# EAGLE design SparkFun_AST-CAN485_IO_Shield (EAGLE 9.1.1)

## Sheet 1 of 2
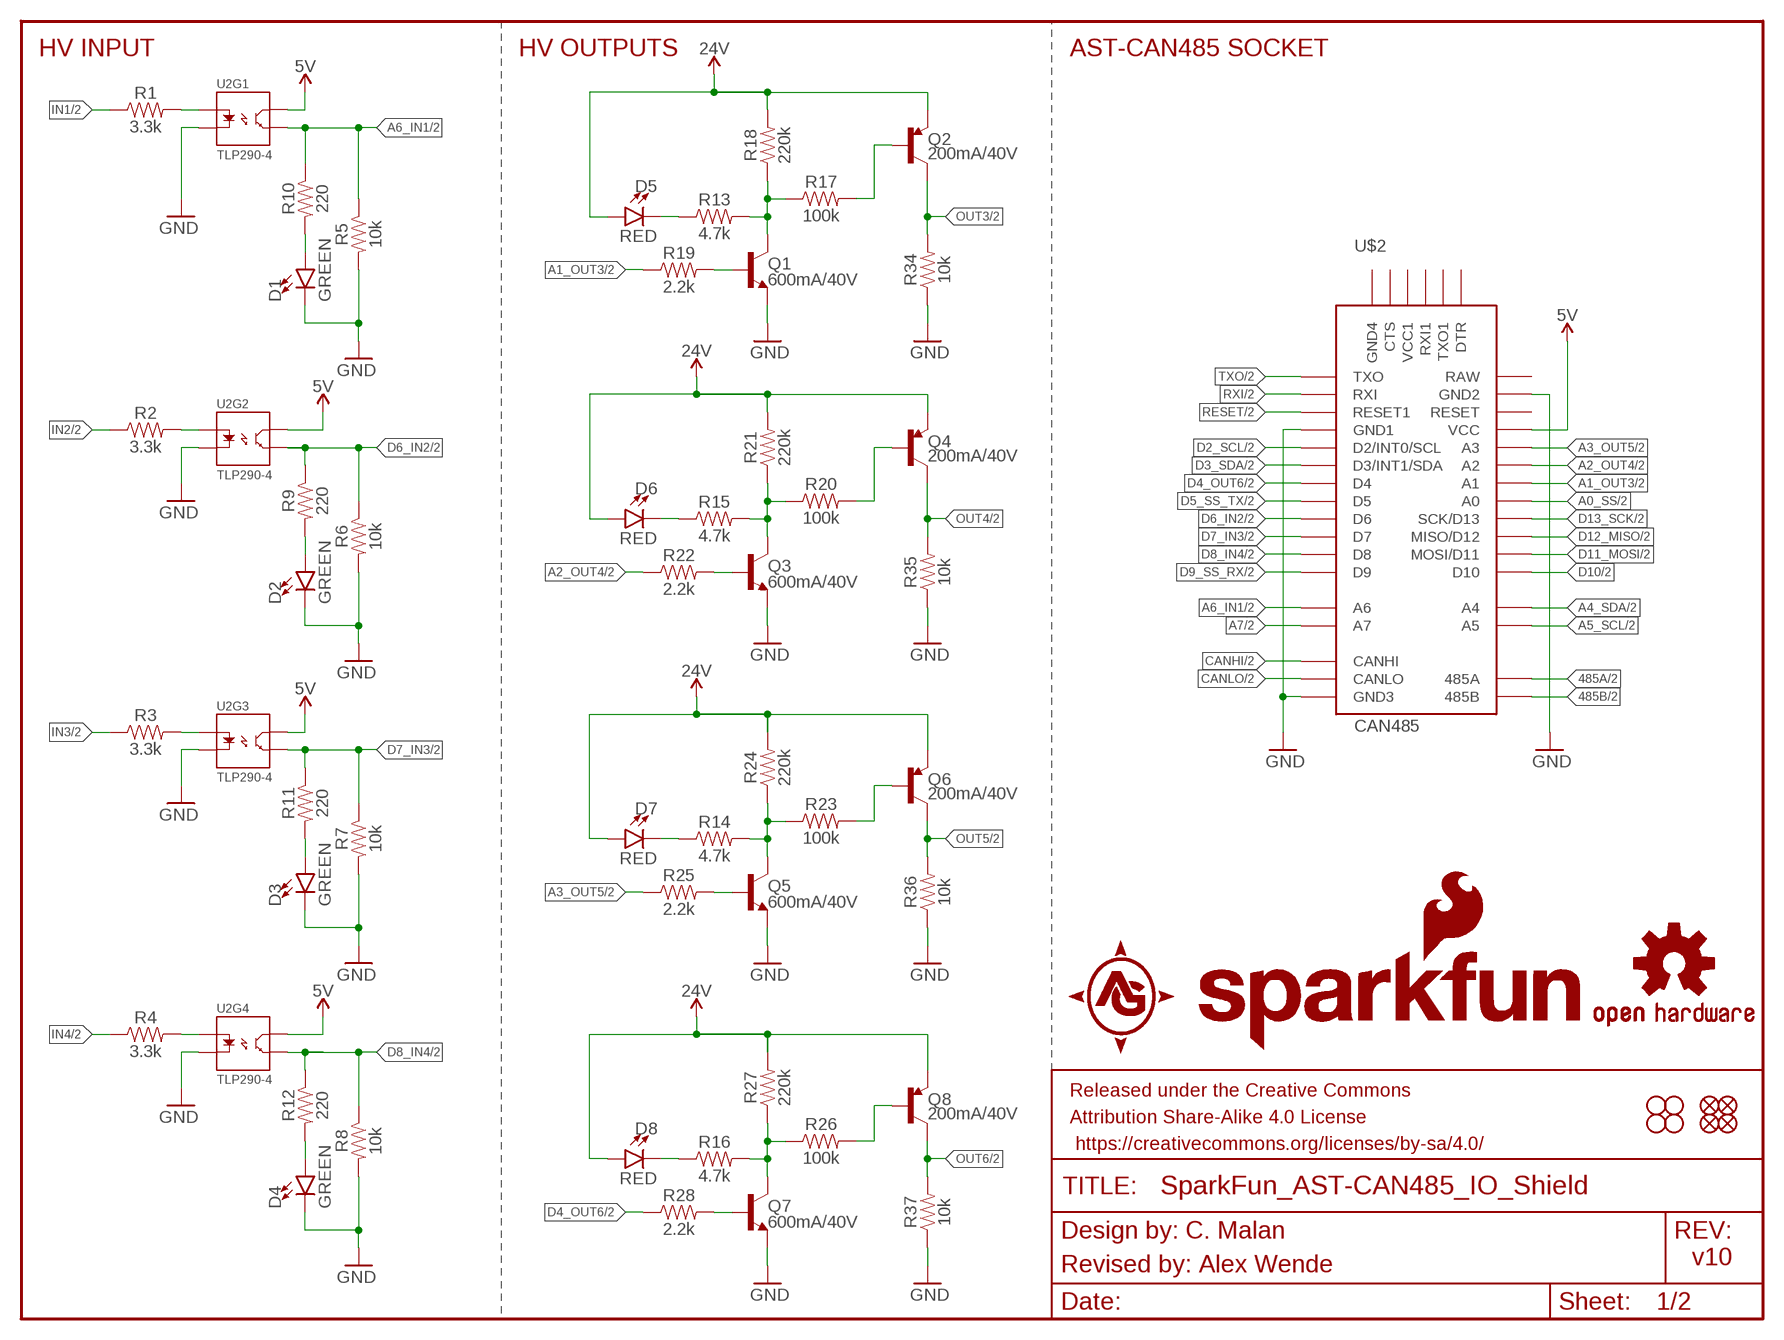
[diagram p0: schematic, sheet 1]

### Parts
D1  GREEN  LED-GREEN0603  [LED-0603]
D2  GREEN  LED-GREEN0603  [LED-0603]
D3  GREEN  LED-GREEN0603  [LED-0603]
D4  GREEN  LED-GREEN0603  [LED-0603]
D5  RED  LED-RED0603  [LED-0603]
D6  RED  LED-RED0603  [LED-0603]
D7  RED  LED-RED0603  [LED-0603]
D8  RED  LED-RED0603  [LED-0603]
FD1  FIDUCIALUFIDUCIAL  [FIDUCIAL-MICRO]
FD2  FIDUCIALUFIDUCIAL  [FIDUCIAL-MICRO]
FD3  FIDUCIALUFIDUCIAL  [FIDUCIAL-MICRO]
FD4  FIDUCIALUFIDUCIAL  [FIDUCIAL-MICRO]
FRAME3  FRAME-LETTER  [CREATIVE_COMMONS]
H1  STAND-OFF  [STAND-OFF]
H2  STAND-OFF  [STAND-OFF]
H3  STAND-OFF  [STAND-OFF]
H4  STAND-OFF  [STAND-OFF]
LOGO1  OSHW-LOGOM  [OSHW-LOGO-M]
LOGO2  SFE_LOGO_NAME_FLAME.2_INCH  [SFE_LOGO_NAME_FLAME_.2]
Q1  600mA/40V  TRANS_NPN-MMBT2222AL  [SOT23-3]
Q2  200mA/40V  TRANS_PNP-PMBT3906|MMBT3906L  [SOT23-3]
Q3  600mA/40V  TRANS_NPN-MMBT2222AL  [SOT23-3]
Q4  200mA/40V  TRANS_PNP-PMBT3906|MMBT3906L  [SOT23-3]
Q5  600mA/40V  TRANS_NPN-MMBT2222AL  [SOT23-3]
Q6  200mA/40V  TRANS_PNP-PMBT3906|MMBT3906L  [SOT23-3]
Q7  600mA/40V  TRANS_NPN-MMBT2222AL  [SOT23-3]
Q8  200mA/40V  TRANS_PNP-PMBT3906|MMBT3906L  [SOT23-3]
R1  3.3k  3.3KOHM-0603-1/10W-1%  [0603]
R2  3.3k  3.3KOHM-0603-1/10W-1%  [0603]
R3  3.3k  3.3KOHM-0603-1/10W-1%  [0603]
R4  3.3k  3.3KOHM-0603-1/10W-1%  [0603]
R5  10k  10KOHM-0603-1/10W-1%  [0603]
R6  10k  10KOHM-0603-1/10W-1%  [0603]
R7  10k  10KOHM-0603-1/10W-1%  [0603]
R8  10k  10KOHM-0603-1/10W-1%  [0603]
R9  220  220OHM-0603-1/10W-1%  [0603]
R10  220  220OHM-0603-1/10W-1%  [0603]
R11  220  220OHM-0603-1/10W-1%  [0603]
R12  220  220OHM-0603-1/10W-1%  [0603]
R13  4.7k  4.7KOHM-0603-1/10W-1%  [0603]
R14  4.7k  4.7KOHM-0603-1/10W-1%  [0603]
R15  4.7k  4.7KOHM-0603-1/10W-1%  [0603]
R16  4.7k  4.7KOHM-0603-1/10W-1%  [0603]
R17  100k  100KOHM-0603-1/10W-1%  [0603]
R18  220k  220KOHM-0603-1/10W-1%  [0603]
R19  2.2k  2.2KOHM-0603-1/10W-1%  [0603]
R20  100k  100KOHM-0603-1/10W-1%  [0603]
R21  220k  220KOHM-0603-1/10W-1%  [0603]
R22  2.2k  2.2KOHM-0603-1/10W-1%  [0603]
R23  100k  100KOHM-0603-1/10W-1%  [0603]
R24  220k  220KOHM-0603-1/10W-1%  [0603]
R25  2.2k  2.2KOHM-0603-1/10W-1%  [0603]
R26  100k  100KOHM-0603-1/10W-1%  [0603]
R27  220k  220KOHM-0603-1/10W-1%  [0603]
R28  2.2k  2.2KOHM-0603-1/10W-1%  [0603]
R34  10k  10KOHM-0603-1/10W-1%  [0603]
R35  10k  10KOHM-0603-1/10W-1%  [0603]
R36  10k  10KOHM-0603-1/10W-1%  [0603]
R37  10k  10KOHM-0603-1/10W-1%  [0603]
U2  TLP290-4  QUAD-OPTOISOLATOR  [SO16]
U$2  CAN485  CAN485FULL_SOCKET  [CAN485]

### Nets
5V: U2.10(CL1) U2.12(CL1) U2.14(CL1) U2.16(CL1) U$2.VCC ; also sheet 2
24V: D5.A D6.A D7.A D8.A Q2.2(E) Q4.2(E) Q6.2(E) Q8.2(E) R18.2 R21.2 R24.2 R27.2 ; also sheet 2
485A: U$2.485A ; also sheet 2
485B: U$2.485B ; also sheet 2
A0_SS: U$2.A0 ; also sheet 2
A1_OUT3: R19.1 U$2.A1 ; also sheet 2
A2_OUT4: R22.1 U$2.A2 ; also sheet 2
A3_OUT5: R25.1 U$2.A3 ; also sheet 2
A4_SDA: U$2.A4 ; also sheet 2
A5_SCL: U$2.A5 ; also sheet 2
A6_IN1: R5.1 R10.1 U2.15(EM1) U$2.A6 ; also sheet 2
A7: U$2.A7 ; also sheet 2
CANHI: U$2.CANHI ; also sheet 2
CANLO: U$2.CANLO ; also sheet 2
D2_SCL: U$2.2(D2/INT0/SCL) ; also sheet 2
D3_SDA: U$2.3(D3/INT1/SDA) ; also sheet 2
D4_OUT6: R28.1 U$2.4(D4) ; also sheet 2
D5_SS_TX: U$2.5(D5) ; also sheet 2
D6_IN2: R6.1 R9.1 U2.13(EM1) U$2.6(D6) ; also sheet 2
D7_IN3: R7.1 R11.1 U2.11(EM1) U$2.7(D7) ; also sheet 2
D8_IN4: R8.1 R12.1 U2.9(EM1) U$2.8(D8) ; also sheet 2
D9_SS_RX: U$2.9(D9) ; also sheet 2
D10: U$2.10(D10) ; also sheet 2
D11_MOSI: U$2.11(MOSI/D11) ; also sheet 2
D12_MISO: U$2.12(MISO/D12) ; also sheet 2
D13_SCK: U$2.13(SCK/D13) ; also sheet 2
GND: D1.C D2.C D3.C D4.C Q1.2(E) Q3.2(E) Q5.2(E) Q7.2(E) R5.2 R6.2 R7.2 R8.2 R34.1 R35.1 R36.1 R37.1 U2.2(C1) U2.4(C1) U2.6(C1) U2.8(C1) U$2.GND1 U$2.GND2 U$2.GND3 ; also sheet 2
IN1: R1.1 ; also sheet 2
IN2: R2.1 ; also sheet 2
IN3: R3.1 ; also sheet 2
IN4: R4.1 ; also sheet 2
N$1: R1.2 U2.1(A1)
N$2: R3.2 U2.5(A1)
N$3: R4.2 U2.7(A1)
N$4: R2.2 U2.3(A1)
N$5: Q2.1(B) R17.2
N$6: Q1.3(C) R13.2 R17.1 R18.1
N$7: Q1.1(B) R19.2
N$8: Q4.1(B) R20.2
N$9: Q3.3(C) R15.2 R20.1 R21.1
N$10: D2.A R9.2
N$11: Q3.1(B) R22.2
N$12: Q6.1(B) R23.2
N$13: Q5.3(C) R14.2 R23.1 R24.1
N$14: Q5.1(B) R25.2
N$15: Q8.1(B) R26.2
N$17: Q7.3(C) R16.2 R26.1 R27.1
N$19: Q7.1(B) R28.2
N$23: D1.A R10.2
N$24: D4.A R12.2
N$25: D3.A R11.2
N$26: D5.C R13.1
N$27: D7.C R14.1
N$28: D6.C R15.1
N$29: D8.C R16.1
OUT3: Q2.3(C) R34.2 ; also sheet 2
OUT4: Q4.3(C) R35.2 ; also sheet 2
OUT5: Q6.3(C) R36.2 ; also sheet 2
OUT6: Q8.3(C) R37.2 ; also sheet 2
RESET: U$2.RST1(RESET1) ; also sheet 2
RXI: U$2.RXI ; also sheet 2
TXO: U$2.TXO ; also sheet 2
Unconnected: U$2.CTS U$2.DTR U$2.GND4 U$2.RAW U$2.RST(RESET) U$2.RXI1 U$2.TXO1 U$2.VCC1

### Notes on the sheet
- HV INPUT | HV OUTPUTS | AST-CAN485 SOCKET
- C. Malan
- v10
- Revised by: Alex Wende

## Sheet 2 of 2
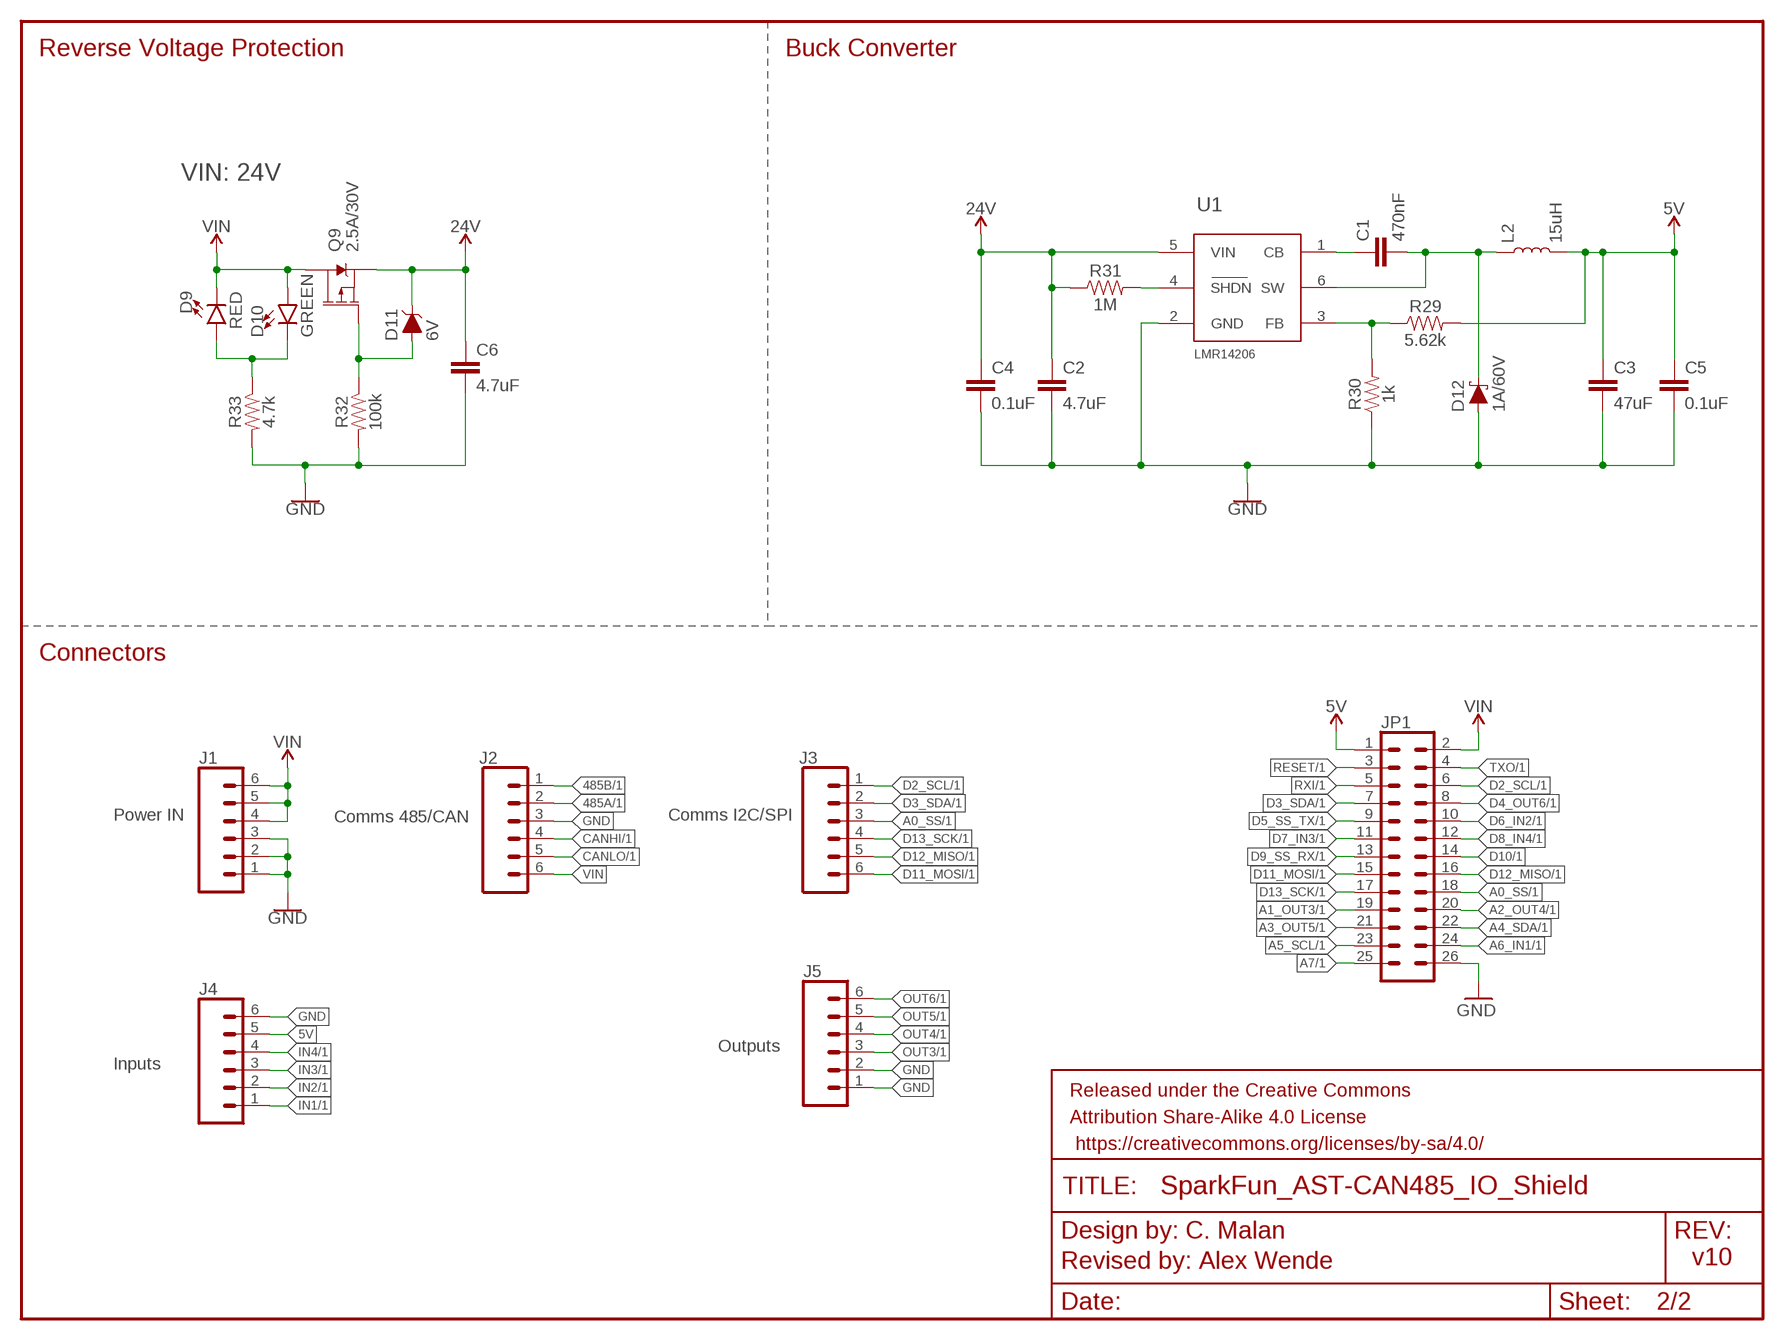
[diagram p1: schematic, sheet 2]

### Parts
C1  470nF  470NF-0603-10V-10%-X5R  [0603]
C2  4.7uF  4.7UF-0603-35V-(20%)  [0603]
C3  47uF  47UF  [0805]
C4  0.1uF  0.1UF-0603-100V-10%  [0603]
C5  0.1uF  0.1UF-0603-25V-(+80/-20%)  [0603]
C6  4.7uF  4.7UF-0603-35V-(20%)  [0603]
D9  RED  LED-RED0603  [LED-0603]
D10  GREEN  LED-GREEN0603  [LED-0603]
D11  6V  DIODE-ZENER-MMBZ5233BLT1G  [SOT23-3]
D12  1A/60V  DIODE-SCHOTTKY-MSS1P6-M3/89A  [DIODE-MICRO-SMP]
FRAME1  FRAME-LETTERNO_PACKAGE  [DUMMY]
J1  CONN_063.5MM-6  [SCREWTERMINAL-3.5MM-6]
J2  CONN_063.5MM-6  [SCREWTERMINAL-3.5MM-6]
J3  CONN_063.5MM-6  [SCREWTERMINAL-3.5MM-6]
J4  CONN_063.5MM-6  [SCREWTERMINAL-3.5MM-6]
J5  CONN_063.5MM-6  [SCREWTERMINAL-3.5MM-6]
JP1  CONN_13X22X13  [2X13]
L2  15uH  INDUCTOR-LHQ32-15UH  [INDUCTOR_LQH32]
Q9  2.5A/30V  MOSFET_PCH-DMG2307L  [SOT23-3]
R29  5.62k  5.62KOHM-0603-1/10W-1%  [0603]
R30  1k  1KOHM-0603-1/10W-1%  [0603]
R31  1M  1MOHM-0603-1/4W-5%  [0603]
R32  100k  100KOHM-0603-1/10W-1%  [0603]
R33  4.7k  4.7KOHM-0603-1/10W-1%  [0603]
U1  LMR14206  LMR14203  [SOT23-6]

### Nets
5V: C3.1 C5.1 J4.5 JP1.1 L2.P$2 R29.2 ; also sheet 1
24V: C2.1 C4.1 C6.1 D11.3(C) Q9.2(S) R31.1 U1.5(VIN) ; also sheet 1
485A: J2.2 ; also sheet 1
485B: J2.1 ; also sheet 1
A0_SS: J3.3 JP1.18 ; also sheet 1
A1_OUT3: JP1.19 ; also sheet 1
A2_OUT4: JP1.20 ; also sheet 1
A3_OUT5: JP1.21 ; also sheet 1
A4_SDA: JP1.22 ; also sheet 1
A5_SCL: JP1.23 ; also sheet 1
A6_IN1: JP1.24 ; also sheet 1
A7: JP1.25 ; also sheet 1
CANHI: J2.4 ; also sheet 1
CANLO: J2.5 ; also sheet 1
D2_SCL: J3.1 JP1.6 ; also sheet 1
D3_SDA: J3.2 JP1.7 ; also sheet 1
D4_OUT6: JP1.8 ; also sheet 1
D5_SS_TX: JP1.9 ; also sheet 1
D6_IN2: JP1.10 ; also sheet 1
D7_IN3: JP1.11 ; also sheet 1
D8_IN4: JP1.12 ; also sheet 1
D9_SS_RX: JP1.13 ; also sheet 1
D10: JP1.14 ; also sheet 1
D11_MOSI: J3.6 JP1.15 ; also sheet 1
D12_MISO: J3.5 JP1.16 ; also sheet 1
D13_SCK: J3.4 JP1.17 ; also sheet 1
FB: R29.1 R30.2 U1.3(FB)
GND: C2.2 C3.2 C4.2 C5.2 C6.2 D12.A J1.1 J1.2 J1.3 J2.3 J4.6 J5.1 J5.2 JP1.26 R30.1 R32.2 R33.2 U1.2(GND) ; also sheet 1
IN1: J4.1 ; also sheet 1
IN2: J4.2 ; also sheet 1
IN3: J4.3 ; also sheet 1
IN4: J4.4 ; also sheet 1
N$33: D9.A D10.C R33.1
N$35: D11.1(A) Q9.1(G) R32.1
OUT3: J5.3 ; also sheet 1
OUT4: J5.4 ; also sheet 1
OUT5: J5.5 ; also sheet 1
OUT6: J5.6 ; also sheet 1
RESET: JP1.3 ; also sheet 1
RXI: JP1.5 ; also sheet 1
SHDN: R31.2 U1.4(SHDN)
TXO: JP1.4 ; also sheet 1
VBOOT: C1.1 U1.1(CB)
VIN: D9.C D10.A J1.4 J1.5 J1.6 J2.6 JP1.2 Q9.3(D)
VSW: C1.2 D12.C L2.P$1 U1.6(SW)

### Notes on the sheet
- Reverse Voltage Protection | Buck Converter
- VIN: 24V
- Connectors
- Power IN | Comms 485/CAN | Comms I2C/SPI
- Outputs
- Inputs
- C. Malan
- Revised by: Alex Wende | v10

## Library data of the parts
C1 = SparkFun-Capacitors:470NF: 0.47uF/470nF ceramic capacitors A capacitor is a passive two-terminal electrical component used to store electrical energy temporarily in an electric field.; PROD_ID: CAP-13216
C2 C6 = SparkFun-Capacitors:4.7UF: 4.7µF ceramic capacitors A capacitor is a passive two-terminal electrical component used to store electrical energy temporarily in an electric field.; PROD_ID: CAP-14106
C3 = SparkFun-Capacitors:47UF; PROD_ID: CAP-13854; VALUE: 47uF/6.3V
C4 = SparkFun-Capacitors:0.1UF: 0.1µF ceramic capacitors A capacitor is a passive two-terminal electrical component used to store electrical energy temporarily in an electric field.; PROD_ID: CAP-08390
C5 = SparkFun-Capacitors:0.1UF: 0.1µF ceramic capacitors A capacitor is a passive two-terminal electrical component used to store electrical energy temporarily in an electric field.; PROD_ID: CAP-00810
D1-D4 D10 = SparkFun-LED:LED-GREEN: Green SMD LED Used in manufacturing of various products at SparkFun Packages: 0603 - SMD 0603 package [Product Link] <http://www.futureelectronics.com/en/technologies/semiconductors/optoelectronics/leds/Pages/9894312-LTST-C190GKT.aspx?CrossPart=HSMG-C190&IM=0> LilyPad 1206 - SMD1206 LilyPad package [Product Link] <http://www.futureelectronics.com/en/Technologies/Product.aspx?ProductID=IN150NGHARVATEKCORPORATION2049943&IM=0> 1206 - SMD1206 package [Product Link] <http://www.futureelectronics.com/en/technologies/semiconductors/optoelectronics/leds/Pages/8315665-LTST-C150KGKT.aspx?IM=0> 1206 Bottom Mount -SMD 1206 Bottom Mount [Product Link] <http://www.digikey.com/product-detail/en/lite-on-inc/LTST-C230KGKT/160-1456-1-ND/386854> SparkFun Products: Pro Mini 328 -5V <https://www.sparkfun.com/products/821> RedBoard <https://www.sparkfun.com/products/12757> MP3 Trigger <https://www.sparkfun.com/products/13720> Makey Makey <https://www.sparkfun.com/products/11076>; PROD_ID: DIO-00821
D5-D9 = SparkFun-LED:LED-RED: Red SMD LED Used in manufacturing of most products at SparkFun Packages: 0603 - SMD 0603 package [Product Link] <http://docs.avagotech.com/docs/AV02-0551EN> 0603 SMART - SMD 0603 SMART package ( more efficient and expensive)[Product Link] <http://www.osram-os.com/Graphics/XPic2/00077099_0.pdf> 1206 - SMD1206 package [Product Link] <https://www.sparkfun.com/datasheets/DevTools/LilyPad/Q150OVS4.pdff> SparkFun Products: Pro Mini 328 -5V <https://www.sparkfun.com/products/821> RedBoard <https://www.sparkfun.com/products/12757> IOIO-OTG <https://www.sparkfun.com/products/13613>; PROD_ID: DIO-00819
D11 = SparkFun-DiscreteSemi:DIODE-ZENER: Zener Diode A Zener diode allows current to flow from its anode to its cathode like a normal semiconductor diode, but it also permits current to flow in the reverse direction when its "Zener voltage" is reached. - WIkipedia; PROD_ID: DIO-14123
D12 = SparkFun-DiscreteSemi:DIODE-SCHOTTKY: Schottky diode A Schottky diode is a semiconductor diode which has a low forward voltage drop and a very fast switching action.; PROD_ID: DIO-13919; VALUE: 1A/60V/520mV
FD1-FD4 = SparkFun-Aesthetics:FIDUCIAL: Fiducial Alignment Points Point-of-reference for pick-and-place machines and other optical instruments.
FRAME1 = SparkFun-Aesthetics:FRAME-LETTER: Schematic Frame - Letter Standard 8.5x11 US Letter frame; DESIGNER: Nobody; VERSION: v01
FRAME3 = SparkFun-Aesthetics:FRAME-LETTER: Schematic Frame - Letter Standard 8.5x11 US Letter frame
H1-H4 = SparkFun-Hardware:STAND-OFF: Stand Off Drill holes for mechanically mounting via screws, standoffs, etc. Note: Use the keepout ring to avoid running the screw head into surrounding components. Variant Overviews STAND-OFF - Mechanical footprint for a #4 phillips button head screw. STAND-OFF-TIGHT - Mechanical footprint for a #4 phillips button head screw, Example SparkFun Products Screw - Phillips Head (1/4", 4-40, 10 pack) (PRT-10453) Screw - Phillips Head (1/2", 4-40, 10 pack) (PRT-10452) Screw - Phillips Head (3/4", 4-40, 10 pack) (PRT-10451) Screw - Phillips Head (1", 4-40, 10 pack) (PRT-10450)
J1-J5 = SparkFun-Connectors:CONN_06: Multi connection point. Often used as Generic Header-pin footprint for 0.1 inch spaced/style header connections On any of the 0.1 inch spaced packages, you can populate with these: Break Away Headers - Straight (PRT-00116) Break Away Male Headers - Right Angle (PRT-00553) Female Headers (PRT-00115) Break Away Headers - Machine Pin (PRT-00117) Break Away Female Headers - Swiss Machine Pin (PRT-00743) Arduino Stackable Header - 6 Pin (PRT-09280) For SCREWTERMINALS and SPRING TERMINALS visit here: Screw Terimnals on SparkFun.com (5mm/3.5mm/2.54mm spacing) This device is also useful as a general connection point to wire up your design to another part of your project. Our various solder wires solder well into these plated through hole pads. Hook-Up Wire - Assortment (Stranded, 22 AWG) (PRT-11375) Hook-Up Wire - Assortment (Solid Core, 22 AWG) (PRT-11367) View the entire wire category on our website here; PROD_ID: CONN-13617
JP1 = SparkFun-Connectors:CONN_13X2: Multi connection point. Often used as Generic Header-pin footprint for 0.1 inch spaced/style header connections On any of the 0.1 inch spaced packages, you can populate with these: Break Away Headers - Straight (PRT-00116) Break Away Male Headers - Right Angle (PRT-00553) Female Headers (PRT-00115) Break Away Headers - Machine Pin (PRT-00117) Break Away Female Headers - Swiss Machine Pin (PRT-00743); PROD_ID: CONN-13385
L2 = SparkFun-Coils:INDUCTOR: Inductors Resist changes in electrical current. Basically a coil of wire. SparkFun Products: SparkFun Load Cell Amplifier - HX711 IOIO-OTG - V2.2; PROD_ID: NDUC-14107
LOGO1 = SparkFun-Aesthetics:OSHW-LOGO: Open-Source Hardware (OSHW) Logo This logo indicates the piece of hardware it is found on incorporates a OSHW license and/or adheres to the definition of open source hardware found here: http://freedomdefined.org/OSHW
LOGO2 = SparkFun-Aesthetics:SFE_LOGO_NAME_FLAME: SparkFun Font Logo w/ Flame This is the SparkFun full logo. The logo on the schematic will always be the same size; the package variant is the height of the flame part of the logo. Default layer for the logo on the board is tSilk.
Q1 Q3 Q5 Q7 = SparkFun-DiscreteSemi:TRANS_NPN: NPN transistor Current controlled devices typically used to amplify current or used as a switch. BC547 - COM-08928 (TO-92 45V 100mA) (1.Collector 2.Base 3.Emitter) 2N3904 - COM-00521 (TO-92 40V 200mA) (1.Emitter 2.Base 3.Collector) P2N2222A - COM-12852 (TO-92 40V 600mA) (1.Collector 2.Base 3.Emitter); PROD_ID: TRANS-08049
Q2 Q4 Q6 Q8 = SparkFun-DiscreteSemi:TRANS_PNP: PNP transistor Current controlled devices typically used to amplify current or used as a switch. SparkFun Products: SparkFun Serial Enabled 16x2 LCD - Red on Black <https://www.sparkfun.com/products/9068> SparkFun Logomatic <https://www.sparkfun.com/products/12772>; PROD_ID: TRANS-08052
Q9 = SparkFun-DiscreteSemi:MOSFET_PCH: P-channel MOSFETs Voltage controlled devices that allow control of high current outputs. SparkFun Products: SparkFun ESP32 Thing <https://www.sparkfun.com/products/13907> SparkFun ESP8266 Thing <https://www.sparkfun.com/products/13231>; PROD_ID: TRANS-11308; VALUE: 2.5A/30V/105mΩ
R1-R4 = SparkFun-Resistors:3.3KOHM: 3.3kΩ resistor A resistor is a passive two-terminal electrical component that implements electrical resistance as a circuit element. Resistors act to reduce current flow, and, at the same time, act to lower voltage levels within circuits. - Wikipedia; PROD_ID: RES-07851
R5-R8 R34-R37 = SparkFun-Resistors:10KOHM: 10kΩ resistor A resistor is a passive two-terminal electrical component that implements electrical resistance as a circuit element. Resistors act to reduce current flow, and, at the same time, act to lower voltage levels within circuits. - Wikipedia; PROD_ID: RES-00824
R9-R12 = SparkFun-Resistors:220OHM: 220Ω resistor A resistor is a passive two-terminal electrical component that implements electrical resistance as a circuit element. Resistors act to reduce current flow, and, at the same time, act to lower voltage levels within circuits. - Wikipedia; PROD_ID: RES-07861
R13-R16 R33 = SparkFun-Resistors:4.7KOHM: 4.7kΩ resistor A resistor is a passive two-terminal electrical component that implements electrical resistance as a circuit element. Resistors act to reduce current flow, and, at the same time, act to lower voltage levels within circuits. - Wikipedia; PROD_ID: RES-07857
R17 R20 R23 R26 R32 = SparkFun-Resistors:100KOHM: 100kΩ resistor A resistor is a passive two-terminal electrical component that implements electrical resistance as a circuit element. Resistors act to reduce current flow, and, at the same time, act to lower voltage levels within circuits. - Wikipedia; PROD_ID: RES-07828
R18 R21 R24 R27 = SparkFun-Resistors:220KOHM: 220kΩ resistor A resistor is a passive two-terminal electrical component that implements electrical resistance as a circuit element. Resistors act to reduce current flow, and, at the same time, act to lower voltage levels within circuits. - Wikipedia; PROD_ID: RES-08969
R19 R22 R25 R28 = SparkFun-Resistors:2.2KOHM: 2.2kΩ resistor A resistor is a passive two-terminal electrical component that implements electrical resistance as a circuit element. Resistors act to reduce current flow, and, at the same time, act to lower voltage levels within circuits. - Wikipedia; PROD_ID: RES-08272
R29 = SparkFun-Resistors:5.62KOHM: 5.62kΩ resistor A resistor is a passive two-terminal electrical component that implements electrical resistance as a circuit element. Resistors act to reduce current flow, and, at the same time, act to lower voltage levels within circuits. - Wikipedia; PROD_ID: RES-09823
R30 = SparkFun-Resistors:1KOHM: 1kΩ resistor A resistor is a passive two-terminal electrical component that implements electrical resistance as a circuit element. Resistors act to reduce current flow, and, at the same time, act to lower voltage levels within circuits. - Wikipedia; PROD_ID: RES-07856
R31 = SparkFun-Resistors:1MOHM: 1MΩ resistor A resistor is a passive two-terminal electrical component that implements electrical resistance as a circuit element. Resistors act to reduce current flow, and, at the same time, act to lower voltage levels within circuits. - Wikipedia; PROD_ID: RES-07868
U1 = SparkFun-IC-Power:LMR14203; PROD_ID: IC-13918
U2 = SparkFun-DiscreteSemi:QUAD-OPTOISOLATOR; PROD_ID: IC-14121
U$2 = SparkFun-Boards:CAN485

## Board
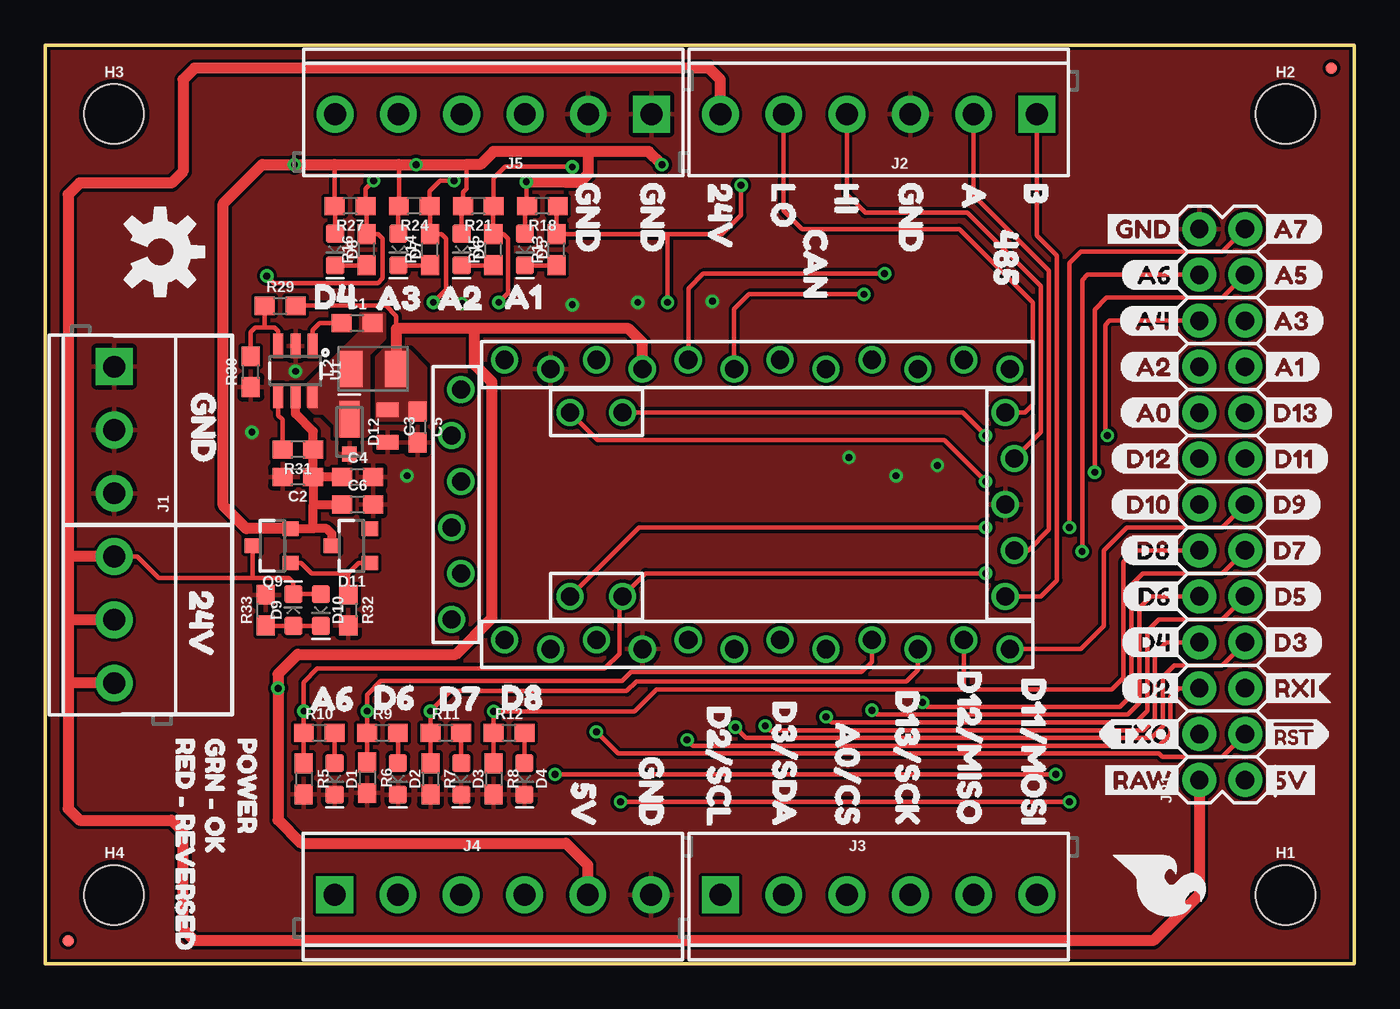
[diagram p2: board, top side]
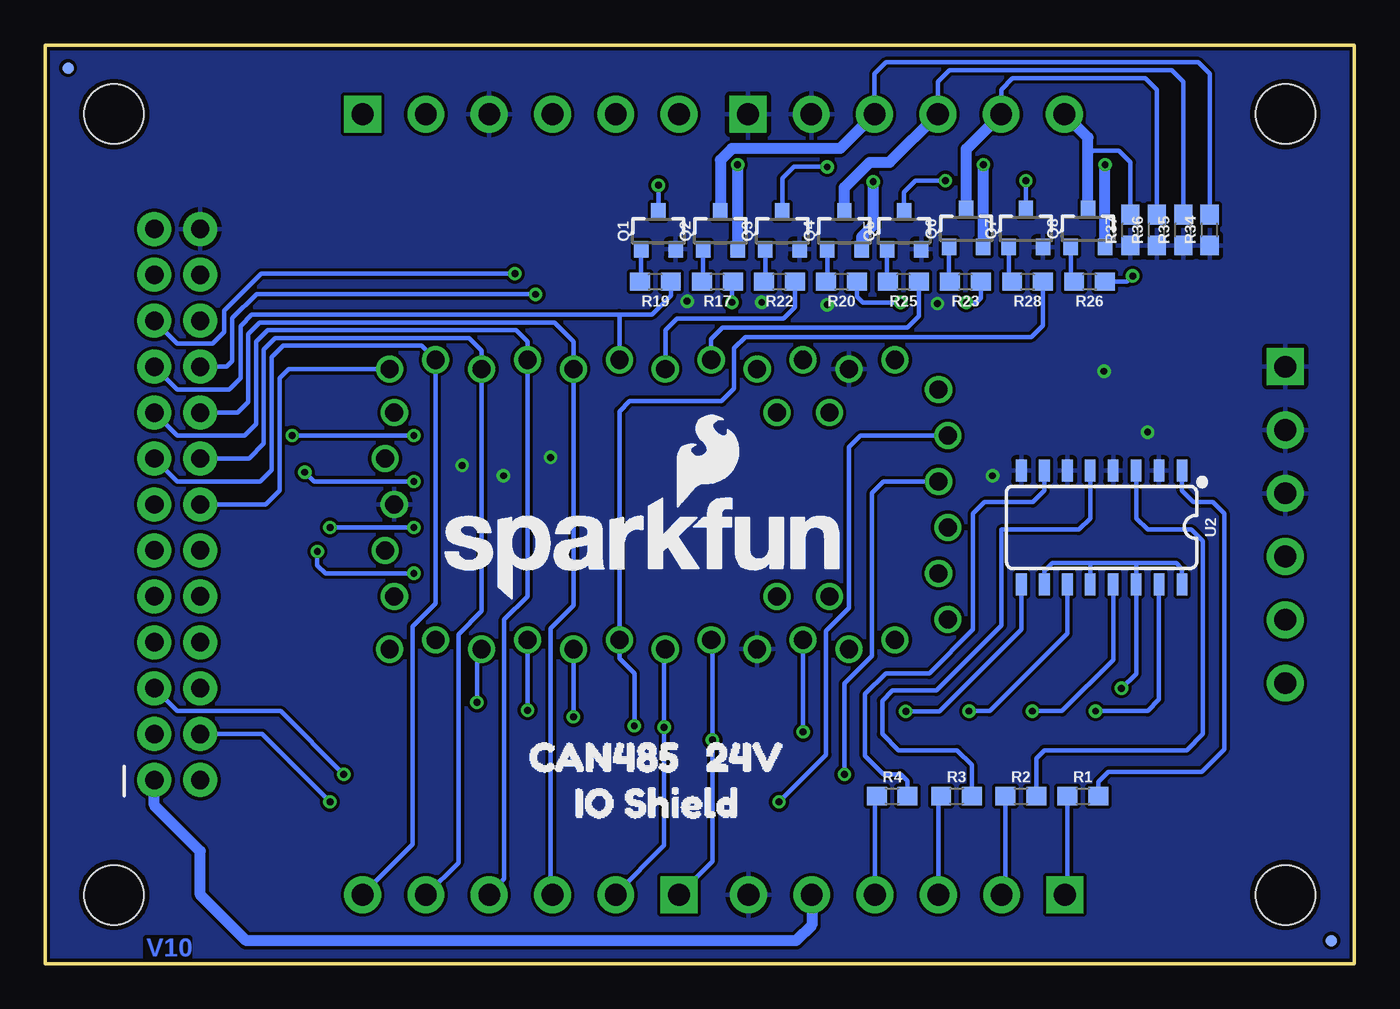
[diagram p3: board, bottom side, seen from below]

Size 72.39 x 50.8 mm. Coordinates in mm from the lower left corner, seen from the top.
Outline: 0,0 72.39,0 72.39,50.8 0,50.8 0,0
Copper layers (1*16): Top 0.035mm / dielectric 1.5mm / Bottom 0.035mm
Design rules "SparkFun-2-layer-TIGHT": minimum track width 7mil, minimum drill 15mil, track to track 7mil, track to pad 7mil, pad to pad 7mil, via to via 7mil, smd to smd 7mil, copper to edge 7mil, drill to drill 7mil, minimum pad ring 7mil, minimum via ring 7mil, stop-mask expansion 4mil, vias tented up to drill 25mil, thermal gap 10mil

### Footprints (pad centres in the part's own frame; a part is rotated, then mirrored left to right if it is on the bottom)
0603 = smd 1.1 x 1: 1 -0.85,0; 2 0.85,0
0805 = smd 0.8 x 1.2: 1 -0.9,0; 2 0.9,0
LED-0603 = smd 1 x 1: A -0.877,0; C 0.877,0
SOT23-3 = smd 0.8 x 0.9: 1 -0.95,-1; 2 0.95,-1; 3 0,1.1
DIODE-MICRO-SMP = smd 0.813 x 0.813: A 1.219,0 | smd 2.007 x 1.102: C -0.699,0
FIDUCIAL-MICRO = smd 0.635 x 0.635: 1 0,0
STAND-OFF = hole 3.302: 0,0
SCREWTERMINAL-3.5MM-6 = drill 1.2 pad 2.032 square: 1 0,0 | drill 1.2 pad 2.032: 2 3.5,0; 3 7,0; 4 10.5,0; 5 14,0; 6 17.5,0
2X13 = drill 1.016 pad 1.88: 1 0,0; 2 0,2.54; 3 2.54,0; 4 2.54,2.54; 5 5.08,0; 6 5.08,2.54; 7 7.62,0; 8 7.62,2.54; 9 10.16,0; 10 10.16,2.54; 11 12.7,0; 12 12.7,2.54; 13 15.24,0; 14 15.24,2.54; 15 17.78,0; 16 17.78,2.54; 17 20.32,0; 18 20.32,2.54; 19 22.86,0; 20 22.86,2.54; 21 25.4,0; 22 25.4,2.54; 23 27.94,0; 24 27.94,2.54; 25 30.48,0; 26 30.48,2.54
INDUCTOR_LQH32 = smd 2 x 1.25: P$1 -0.07,1.205; P$2 -0.07,-1.295
SOT23-6 = smd 0.55 x 1.35: 1 -0.95,-1.375; 2 0,-1.375; 3 0.95,-1.375; 4 0.95,1.375; 5 0,1.375; 6 -0.95,1.375
SO16 = smd 0.6 x 1.2: 1 -4.445,-3.15; 2 -3.175,-3.15; 3 -1.905,-3.15; 4 -0.635,-3.15; 5 0.635,-3.15; 6 1.905,-3.15; 7 3.175,-3.15; 8 4.445,-3.15; 9 4.445,3.15; 10 3.175,3.15; 11 1.905,3.15; 12 0.635,3.15; 13 -0.635,3.15; 14 -1.905,3.15; 15 -3.175,3.15; 16 -4.445,3.15
CAN485 = drill 1: 2 -7.493,2.54; 3 -8.001,0; 4 -7.493,-2.54; 5 -8.001,-5.08; 6 -7.493,-7.62; 7 -8.001,-10.16; 8 -7.493,-12.7; 9 -8.001,-15.24; 10 7.493,-15.24; 11 8.001,-12.7; 12 7.493,-10.16; 13 8.001,-7.62; 485A -2.54,-15.494; 485B -5.08,-14.986; A0 7.493,-5.08; A1 8.001,-2.54; A2 7.493,0; A3 8.001,2.54; A4 5.08,6.172; A5 5.08,9.068; A6 -5.08,6.172; A7 -5.08,9.068; CANHI 2.54,-15.494; CANLO 5.08,-14.986; CTS -3.81,15.113; DTR 6.35,15.113; GND1 -8.001,5.08; GND2 7.493,10.16; GND3 0,-14.986; GND4 -6.35,15.621; RAW 8.001,12.7; RST 8.001,7.62; RST1 -7.493,7.62; RXI 1.27,15.113; RXI1 -8.001,10.16; TXO 3.81,15.621; TXO1 -7.493,12.7; VCC 7.493,5.08; VCC1 -1.27,15.621

### Placement (x,y rotation side)
C1  17.25,35.43 0 top
C2  13.97,26.92 180 top
C3  18.94,29.73 270 top
C4  17.27,26.92 0 top
C5  20.59,29.68 270 top
C6  17.27,25.4 0 top
D1  16,10.22 270 top
D2  19.5,10.22 270 top
D3  23,10.22 270 top
D4  26.5,10.22 270 top
D5  26.53,39.5 270 top
D6  23.03,39.5 270 top
D7  19.53,39.5 270 top
D8  16.03,39.5 270 top
D9  13.72,19.56 90 top
D10  15.24,19.56 270 top
D11  16.95,23.11 90 top
D12  16.83,29.41 270 top
FD1  1.27,1.27 0 top
FD2  1.27,1.27 0 bottom
FD3  71.12,49.53 0 top
FD4  71.12,49.53 0 bottom
FRAME1  -7.62,-19.05 0 top  (outside the outline)
FRAME3  12.7,-17.78 0 top  (outside the outline)
H1  68.58,3.81 0 top
H2  68.58,46.99 0 top
H3  3.81,46.99 0 top
H4  3.81,3.81 0 top
J1  3.81,33.02 270 top
J2  54.84,46.99 180 top
J3  37.34,3.81 0 top
J4  16,3.81 0 top
J5  33.53,46.99 180 top
JP1  66.36,10.16 90 top
L2  18.12,32.96 90 top
LOGO1  6.35,39.37 270 top
LOGO2  50.99,20.07 0 bottom
Q1  38.48,40.51 0 bottom
Q2  35.05,40.51 0 bottom
Q3  31.62,40.51 0 bottom
Q4  28.19,40.51 0 bottom
Q5  24.89,40.51 0 bottom
Q6  21.46,40.64 0 bottom
Q7  18.16,40.64 0 bottom
Q8  14.73,40.64 0 bottom
Q9  12.57,23.11 90 top
R1  15.01,9.27 0 bottom
R2  18.44,9.27 0 bottom
R3  22,9.27 0 bottom
R4  25.55,9.27 0 bottom
R5  14.3,10.22 270 top
R6  17.8,10.29 270 top
R7  21.3,10.22 270 top
R8  24.8,10.22 270 top
R9  18.65,12.76 0 top
R10  15.15,12.76 0 top
R11  22.15,12.76 0 top
R12  25.65,12.76 0 top
R13  28.28,39.5 90 top
R14  21.28,39.5 90 top
R15  24.78,39.5 90 top
R16  17.78,39.5 90 top
R17  35.22,37.72 180 bottom
R18  27.49,41.91 180 top
R19  38.65,37.72 180 bottom
R20  28.36,37.72 180 bottom
R21  23.95,41.91 180 top
R22  31.79,37.72 180 bottom
R23  21.5,37.72 180 bottom
R24  20.41,41.91 180 top
R25  24.93,37.72 180 bottom
R26  14.64,37.72 180 bottom
R27  16.86,41.91 180 top
R28  18.07,37.72 180 bottom
R29  12.99,36.39 0 top
R30  11.37,32.74 90 top
R31  13.97,28.45 180 top
R32  16.76,19.56 270 top
R33  12.19,19.56 90 top
R34  8,40.58 90 bottom
R35  9.46,40.58 90 bottom
R36  10.92,40.58 90 bottom
R37  12.38,40.58 90 bottom
U1  13.84,32.79 180 top
U2  13.97,24.13 180 bottom
U$1  [#RST27]  66.87,12.7 0 top
U$2  38.1,25.4 90 top
U$3  [5V26]  66.99,10.16 0 top
U$4  [A60]  59.44,38.1 0 top
U$5  [D319]  66.99,17.78 0 top
U$6  [D517]  67.06,20.32 0 top
U$7  [D715]  66.99,22.86 0 top
U$8  [D913]  66.99,25.4 0 top
U$9  [D1111]  67.06,27.94 0 top
U$10  [D139]  66.99,30.48 0 top
U$11  [A17]  67.06,33.02 0 top
U$12  [A35]  66.99,35.56 0 top
U$13  [A53]  67.06,38.1 0 top
U$14  [A71]  66.99,40.64 0 top
U$15  [GND0]  58.29,40.64 0 top
U$16  [RAW25]  58.1,10.16 0 top
U$17  [RXI10]  67.06,15.24 0 top
U$18  [A41]  59.37,35.56 0 top
U$19  [A22]  59.37,33.02 0 top
U$20  [A03]  59.37,30.48 0 top
U$21  [D124]  58.86,27.94 0 top
U$22  [D105]  58.86,25.4 0 top
U$23  [D86]  59.44,22.86 0 top
U$24  [D67]  59.5,20.32 0 top
U$25  [D48]  59.5,17.78 0 top
U$26  [D29]  59.44,15.24 0 top
U$27  [TXO11]  58.17,12.7 0 top
U$28  [5V19]  29.78,11.18 270 top
U$29  [GND0]  33.53,12.57 270 top
U$30  [D818]  24.07,14.73 0 top
U$31  [D717]  20.64,14.67 0 top
U$32  [D616]  17.02,14.73 0 top
U$33  [A615]  13.53,14.67 0 top
U$34  [D2#SCL20]  37.27,15.37 270 top
U$35  [D3#SDA21]  40.89,15.68 270 top
U$36  [A0#CS22]  44.39,14.48 270 top
U$37  [D13#SCK23]  47.69,16.26 270 top
U$38  [D12#MISO24]  51.12,17.34 270 top
U$39  [D11#MOSI25]  54.67,16.95 270 top
U$40  [D413]  13.72,36.89 0 top
U$41  [A311]  16.95,36.83 0 top
U$42  [_A210]  19.88,36.83 0 top
U$43  [A112]  24.07,36.89 0 top
U$44  [GND0]  30.04,44.32 270 top
U$45  [GND0]  33.59,44.32 270 top
U$46  [24V1]  37.34,44.32 270 top
U$47  [LO2]  40.83,44.32 270 top
U$48  [HI3]  44.32,44.32 270 top
U$49  [GND0]  47.88,44.32 270 top
U$50  [A6]  51.37,44.32 270 top
U$51  [B7]  54.8,44.32 270 top
U$52  [4858]  53.15,41.72 270 top
U$53  [CAN4]  42.61,41.78 270 top
U$54  [24V1]  8.64,21.78 270 top
U$55  [GND0]  8.76,32.7 270 top
U$56  [RED_#_REVERSED3]  7.75,13.4 270 top
U$57  [GRN_#_OK1]  9.4,13.4 270 top
U$58  [POWER0]  11.18,13.4 270 top
U$59  [CAN4850]  46.99,11.43 0 bottom
U$60  [SFE_LOGO_FLAME_.2]  58.8,6.35 270 top
U$61  [24V1]  37.27,11.43 0 bottom
U$62  [IO_SHIELD2]  44.51,8.89 0 bottom

### Tracks (layer width: path | path; a pad name or v marks a point on that pad's centre or on a via)
5V  (via drill 0.38)
  Top 0.254: R29.2 18.86,36.39 19.42,35.83 19.42,35.12
  Top 0.61: L2.P$2 19.42,35.12 23.75,35.12 | J4.5 30,5.46 28.8,6.67 14.16,6.67 12.88,7.95 v12.88,15.23 12.88,16.02 13.97,17.12 22.71,17.12 24.7,19.11 24.7,32.17 23.75,33.12 23.75,35.12 | 23.75,35.12 32.26,35.12 33.02,34.35 U$2.VCC
  Bottom 0.254: v12.88,15.23 v12.87,15.23 12.06,16.04 U2.14 12.06,22.16 | U2.10 17.14,21.72 16.7,22.16 14.61,22.16 | 14.61,22.16 12.06,22.16 | 12.06,22.16 9.84,22.16 9.53,21.84 U2.16 | U2.12 14.61,22.16
  Bottom 0.61: J4.5 30,2.13 30.86,1.27 61.28,1.27 63.82,3.81 63.82,6.22 66.36,8.76 JP1.1
  pour Top (no thermals): 18.35,30.1 18.35,33.53 18.73,33.91 20.07,33.91 21.02,32.96 21.02,30.1
24V  (via drill 0.38)
  Top 0.254: D8.A 16.03,41.9 R27.2 16.02,44.18 16,44.2 | D7.A 19.53,41.88 R24.2 19.56,44.2 | 23.3,44.2 23.3,42.88 23.1,42.67 R21.2 23.03,41.91 D6.A | v26.61,43.24 26.61,41.95 | 26.61,41.95 R18.2 | D5.A 26.53,41.87 26.61,41.95
  Top 0.508: C4.1 C2.1 | C2.1 R31.1 14.82,29.44 13.84,30.42 U1.5 | Q9.2 14.82,24.06 | 14.82,25.4 C6.1 | C2.1 14.82,25.4 | 14.82,24.06 14.82,25.4 | 14.82,24.06 14.82,24.07 15.56,24.07 15.85,23.77 D11.3
  Top 0.61: Q9.2 11.12,24.06 9.84,25.34 9.84,42.04 12,44.2 v13.78,44.2 16,44.2 19.56,44.2 v20.51,44.2 23.3,44.2 24.07,44.2 24.79,44.92 30.04,44.92 | v34.1,44.2 33.37,44.92 30.04,44.92 | v26.61,43.24 28.77,43.24 28.79,43.22 29.57,43.22 30.04,43.69 30.04,44.92
  Bottom 0.61: v34.1,44.2 Q2.2 | v26.61,43.24 26.61,40.83 27.24,40.19 Q4.2 | Q6.2 v20.51,44.2 | Q8.2 v13.78,44.2
485A
  Top 0.254: J2.2 51.34,42.5 55.5,38.34 55.5,24 54.36,22.86 U$2.485A
485B
  Top 0.254: J2.1 54.84,40.26 55.94,39.15 55.94,21.21 55.05,20.32 U$2.485B
A0_SS
  Bottom 0.254: JP1.18 61.73,30.48 61.16,31.05 61.16,34.84 60.53,35.47 45.63,35.47 44.23,35.47 43.18,34.42 U$2.A0 43.18,19.81 44.45,18.54 44.45,3.92 J3.3
A1_OUT3
  Bottom 0.254: 40.64,35.9 60.96,35.9 61.59,35.27 61.59,32.38 62.23,31.75 65.09,31.75 JP1.19 | 40.64,35.9 38.84,35.9 37.8,36.94 R19.1 | U$2.A1 40.64,35.9
A2_OUT4  (via drill 0.38)
  Top 0.254: v45.28,37.02 38.92,37.02 38.1,36.2 U$2.A2
  Bottom 0.254: R22.1 30.94,36.31 31.56,35.69 37.47,35.69 38.1,35.05 U$2.A2 | JP1.20 62.36,33.02 62.04,33.34 62.04,35.7 60.71,37.03 45.29,37.03 v45.28,37.02
A3_OUT5  (via drill 0.38)
  Top 0.254: v46.42,38.16 36.39,38.16 35.56,37.34 U$2.A3
  Bottom 0.254: R25.1 24.08,35.81 24.72,35.18 34.92,35.18 35.56,34.54 U$2.A3 | JP1.21 65.09,34.29 63.12,34.29 62.48,34.92 62.48,36.13 60.45,38.16 v46.42,38.16
A4_SDA  (via drill 0.38)
  Top 0.254: v52.01,29.21 50.74,30.48 31.95,30.48 U$2.A4 | v58.74,29.21 58.61,29.34 58.61,33.02 58.61,35.33 58.84,35.56 JP1.22
  Bottom 0.254: v52.01,29.21 v58.74,29.21
A5_SCL  (via drill 0.38)
  Top 0.254: v52.01,26.67 49.72,28.96 30.56,28.96 U$2.A5 | v58.04,27.18 58.04,36.18 58.69,36.83 65.09,36.83 JP1.23
  Bottom 0.254: v52.01,26.67 57.53,26.67 v58.04,27.18
A6_IN1  (via drill 0.38)
  Top 0.254: v57.34,22.8 57.34,37.81 57.63,38.1 JP1.24 | R5.1 R10.1 v14.3,13.97 14.3,15.57 15.05,16.32 30.92,16.32 31.75,17.14 31.75,20.14 U$2.A6 33.2,21.59 v52.01,21.59
  Bottom 0.254: v52.01,21.59 56.9,21.59 57.34,22.04 v57.34,22.8 | v14.3,13.97 11.43,13.97 10.79,14.61 U2.15
A7  (via drill 0.38)
  Top 0.254: v56.64,24.13 56.64,38.73 57.28,39.37 65.09,39.37 JP1.25 | U$2.A7 32.84,24.13 v52.01,24.13
  Bottom 0.254: v52.01,24.13 v56.64,24.13
CANHI
  Top 0.254: J2.4 44.34,42.55 45.35,41.53 50.99,41.53 55.05,37.47 55.05,29.4 U$2.CANHI
CANLO
  Top 0.254: J2.5 40.84,41.66 41.85,40.64 50.55,40.64 54.61,36.58 54.61,30.92 54.17,30.48 U$2.CANLO
D2_SCL  (via drill 0.38)
  Top 0.254: v35.5,12.38 35.83,12.05 61.59,12.05 62.23,12.69 62.23,14.8 62.67,15.24 JP1.6
  Bottom 0.254: J3.1 35.5,5.65 v35.5,12.38 35.5,17.84 U$2.2
D3_SDA  (via drill 0.38)
  Top 0.254: v38.16,13.08 38.76,12.48 61.16,12.48 61.8,13.12 61.8,15.88 62.43,16.51 65.09,16.51 JP1.7
  Bottom 0.254: J3.2 40.84,3.87 38.16,6.54 v38.16,13.08 38.16,17.34 U$2.3
D4_OUT6  (via drill 0.38)
  Top 0.254: v39.81,13.16 40.06,12.92 60.73,12.92 61.37,13.55 61.37,17.14 62,17.78 JP1.8
  Bottom 0.254: R28.1 17.22,35.31 17.86,34.67 33.66,34.67 34.29,34.04 34.29,31.81 34.99,31.11 40.07,31.11 40.64,30.54 U$2.4 40.64,16.89 39.81,16.07 v39.81,13.16
D5_SS_TX  (via drill 0.38)
  Top 0.254: v43.18,13.65 43.48,13.35 52.13,13.35 60.3,13.35 60.94,13.98 60.94,18.41 61.57,19.05 64.77,19.05 | 64.77,19.05 65.09,19.05 | 64.77,19.05 65.09,19.05 | 65.09,19.05 JP1.9
  Bottom 0.254: v43.18,13.65 U$2.5
D6_IN2  (via drill 0.38)
  Top 0.254: v45.72,14.02 45.96,13.78 59.87,13.78 60.5,14.41 60.5,19.68 61.14,20.32 JP1.10 | U$2.6 45.72,16.7 45.15,16.13 32.4,16.13 31.9,15.63 18.55,15.63 17.8,14.88 v17.8,13.97 R9.1 R6.1
  Bottom 0.254: v45.72,14.02 U$2.6 | v17.8,13.97 16.17,13.97 13.34,16.8 U2.13
D7_IN3  (via drill 0.38)
  Top 0.254: v48.51,14.45 48.76,14.21 59.44,14.21 60.07,14.85 60.07,20.95 60.71,21.59 65.09,21.59 JP1.11 | U$2.7 48.26,16.26 47.62,15.62 32.69,15.62 32.15,15.07 22.41,15.07 v21.3,13.97 R11.1 R7.1
  Bottom 0.254: v48.51,14.45 48.51,16.64 48.26,16.89 U$2.7 | v21.3,13.97 20.16,13.97 15.88,18.25 U2.11
D8_IN4  (via drill 0.38)
  Top 0.254: 50.8,15.16 58.99,15.16 59.63,15.8 59.63,22.23 60.26,22.86 JP1.12 | U$2.8 50.8,15.16 | 50.8,15.16 33.8,15.16 32.59,13.96 v24.8,13.96 R12.1 R8.1
  Bottom 0.254: v24.8,13.96 22.94,13.96 18.41,18.48 U2.9
D9_SS_RX
  Top 0.254: JP1.13 65.09,24.13 59.82,24.13 58.55,22.86 58.55,18.67 57.94,18.07 57.28,17.4 U$2.9
D10
  Bottom 0.254: JP1.14 60.2,25.4 59.44,26.16 59.44,32.38 58.93,32.89 U$2.10
D11_MOSI
  Bottom 0.254: J3.6 54.84,3.85 52.08,6.6 52.08,18.66 50.8,19.94 U$2.11 51.58,34.18 59.23,34.18 59.87,33.54 59.87,27.3 60.5,26.67 65.09,26.67 JP1.15
D12_MISO
  Bottom 0.254: J3.5 51.32,3.81 49.54,5.59 49.54,18.22 48.26,19.51 U$2.12 48.26,33.91 48.96,34.61 49.85,34.61 59.66,34.61 60.3,33.97 60.3,28.77 61.12,27.94 JP1.16
D13_SCK
  Bottom 0.254: J3.4 47.84,3.86 47,4.7 47,19.04 45.72,20.32 U$2.13 45.72,34.42 46.34,35.04 60.1,35.04 60.73,34.41 60.73,29.84 61.37,29.21 65.09,29.21 JP1.17
FB
  Top 0.254: 12.19,35.18 12.7,35.18 12.89,34.99 U1.3 | R30.2 11.37,34.92 11.62,35.18 12.19,35.18 | R29.1 12.14,35.23 12.19,35.18
GND  (via drill 0.38)
  other vias: 11.43,29.4 13.84,32.77 20,26.99 44.45,28 47.05,26.99 49.34,27.56 29.15,36.45 32.77,36.58 36.89,36.64 23.05,36.51
  pour Bottom (rank 2): 0,50.8 0,0 72.39,0 72.39,50.8
  pour Top (rank 2): 0,50.8 0,0 72.39,0 72.39,50.8
IN1
  Bottom 0.254: R1.1 15.86,3.95 J4.1
IN2
  Bottom 0.254: R2.1 19.29,4.02 J4.2
IN3
  Bottom 0.254: R3.1 23,9.11 J4.3
IN4
  Bottom 0.254: R4.1 26.5,9.17 J4.4
N$1
  Bottom 0.254: R1.2 14.16,10.05 13.59,10.62 8.43,10.62 7.19,11.86 7.19,24.89 7.82,25.53 8.89,25.53 9.46,26.1 9.53,26.16 U2.1
N$2
  Bottom 0.254: R3.2 21.14,10.99 21.97,11.81 25.21,11.81 26.1,12.7 26.1,14.54 25.53,15.11 23.11,15.11 19.51,18.72 19.51,24 15.24,24 14.61,24.64 U2.5
N$3
  Bottom 0.254: R4.2 24.7,10.11 25.08,10.48 26.03,10.48 27.05,11.51 27.05,14.91 25.91,16.05 23.51,16.05 21.08,18.48 21.08,24.89 20.45,25.53 17.78,25.53 17.21,26.1 17.14,26.16 U2.7
N$4
  Bottom 0.254: R2.2 17.59,11.37 17.14,11.81 9.27,11.81 8.38,12.7 8.38,23.37 9.02,24 11.43,24 12.06,24.64 U2.3
N$5
  Bottom 0.254: Q2.1 36,37.78 R17.2
N$6  (via drill 0.38)
  Top 0.254: 34.42,40.35 R13.2 28.28,41.84 R18.1 | 34.42,40.35 v34.42,36.58 | 34.42,40.35 37.43,40.35 38.48,41.4 v38.48,43.05
  Bottom 0.254: v34.42,36.58 34.42,37.72 R17.1 | v38.48,43.05 Q1.3
N$7
  Bottom 0.254: Q1.1 39.43,38.1 39.37,38.1 39.37,37.72 R19.2
N$8
  Bottom 0.254: Q4.1 29.14,37.78 R20.2
N$9  (via drill 0.38)
  Top 0.254: v29.15,44.07 25.44,44.07 24.8,43.43 R21.1 24.78,41.91 R15.2 25.35,40.35 25.59,40.11 25.59,37.08 v25.08,36.58
  Bottom 0.254: v25.08,36.58 27.18,36.58 27.51,36.91 R20.1 | Q3.3 31.62,43.43 30.99,44.07 v29.15,44.07
N$10
  Top 0.254: R9.2 D2.A
N$11
  Bottom 0.254: Q3.1 32.57,37.78 R22.2
N$12
  Bottom 0.254: Q6.1 22.41,37.72 R23.2
N$13  (via drill 0.38)
  Top 0.254: v22.61,43.31 21.84,43.31 21.26,42.72 R24.1 21.28,41.89 R14.2 21.91,40.35 22.16,40.1 22.16,37.27 v21.46,36.58
  Bottom 0.254: v21.46,36.58 20.89,36.58 20.65,36.82 R23.1 | Q5.3 24.89,42.67 24.26,43.31 v22.61,43.31
N$14
  Bottom 0.254: Q5.1 25.84,37.78 R25.2
N$15
  Bottom 0.254: R26.2 15.68,37.72 Q8.1
N$17  (via drill 0.38)
  Top 0.254: v18.16,43.31 17.71,42.86 R27.1 17.78,41.85 R16.2 18.41,40.35 18.67,40.09 18.67,39.37 18.67,37.91 18.41,37.66 12.64,37.66 v12.26,38.04
  Bottom 0.254: R26.1 12.57,37.72 v12.26,38.04 | Q7.3 v18.16,43.31
N$19
  Bottom 0.254: Q7.1 19.11,37.72 R28.2
N$23
  Top 0.254: R10.2 D1.A
N$24
  Top 0.254: R12.2 D4.A
N$25
  Top 0.254: R11.2 D3.A
N$26
  Top 0.254: D5.C 28.25,38.62 R13.1
N$27
  Top 0.254: D7.C 21.25,38.62 R14.1
N$28
  Top 0.254: D6.C 24.75,38.62 R15.1
N$29
  Top 0.254: D8.C 17.75,38.62 R16.1
N$33
  Top 0.254: R33.1 12.22,18.68 D9.A D10.C
N$35
  Top 0.254: Q9.1 14.16,22.16 14.73,21.59 16.76,21.59 | 16.76,21.59 R32.1 | D11.1 17.34,22.16 16.76,21.59
OUT3
  Bottom 0.254: R34.2 8,49.21 8.64,49.85 25.89,49.85 26.53,49.21 J5.3
  Bottom 0.61: J5.3 28.43,45.09 34.42,45.09 35.05,44.45 Q2.3
OUT4
  Bottom 0.254: R35.2 9.46,48.78 10.1,49.42 22.39,49.42 23.03,48.78 J5.4
  Bottom 0.61: Q4.3 28.19,42.93 26.8,44.32 25.7,44.32 J5.4
OUT5
  Bottom 0.254: R36.2 10.92,48.35 11.56,48.98 18.89,48.98 19.53,48.35 J5.5
  Bottom 0.61: Q6.3 21.46,45.05 J5.5
OUT6
  Bottom 0.254: R37.2 12.38,44.32 13.02,44.96 14.67,44.96 14.73,44.9
  Bottom 0.61: Q8.3 14.73,44.9 14.73,45.69 J5.6
RESET  (via drill 0.38)
  Top 0.254: v30.48,12.83 31.69,11.62 61.59,11.62 61.78,11.43 64.77,11.43 | 64.77,11.43 65.09,11.43 | 64.77,11.43 65.09,11.43 | 65.09,11.43 JP1.3
  Bottom 0.254: v30.48,12.83 U$2.RST1
RXI  (via drill 0.38)
  Top 0.254: v55.88,10.48 v28.19,10.48
  Bottom 0.254: v55.88,10.48 59.37,13.97 65.09,13.97 JP1.5 | v28.19,10.48 28.19,15.49 26.67,17.02 26.67,26.04 26.04,26.67 U$2.RXI
SHDN
  Top 0.254: U1.4 12.89,30.33 13.12,30.1 R31.2
TXO  (via drill 0.38)
  Top 0.254: v56.64,8.95 v31.81,8.95
  Bottom 0.254: U$2.TXO 27.3,29.21 27.94,28.57 27.94,19.68 29.21,18.41 29.21,11.56 v31.81,8.95 | JP1.4 60.39,12.7 v56.64,8.95
VBOOT
  Top 0.254: C1.1 15.18,35.43 14.79,35.05 U1.1
VIN
  Top 0.254: D10.A 15.23,20.45 14.48,20.45 13.73,20.45 D9.C 13.72,21.08 13.46,21.34 11.47,21.34 | Q9.3 11.47,21.34 | J1.4 5.08,22.52 6.26,21.34 10.96,21.34 11.35,21.34 11.47,21.34
  Top 0.61: J1.4 1.27,22.52 | 1.27,22.52 1.27,19.05 | 1.27,19.05 1.27,15.68 | 1.27,15.68 1.27,8.57 1.91,7.94 6.99,7.94 7.62,7.3 7.62,1.91 8.26,1.27 61.28,1.27 63.82,3.81 JP1.2 | J1.5 1.27,19.02 1.27,19.05 | J1.6 1.27,15.52 1.27,15.68 | J2.6 37.34,48.9 36.7,49.53 8.26,49.53 7.62,48.9 7.62,43.81 6.99,43.18 1.91,43.18 1.27,42.55 1.27,22.52
VSW
  pour Top (no thermals): 17.97,35.94 18.73,35.94 18.73,34.61 17.84,33.72 17.84,29.34 17.72,29.21 16.07,29.21 16.07,29.84 15.43,30.48 14.92,30.48 14.54,30.86 14.54,32 14.8,32.26 15.94,33.4 17.08,34.54 17.46,34.92 17.46,35.94

### Text on the board
Bottom: V10
Measures: Units: Inches
tDocu: C. Malan | Revised by: Alex Wende